# Altium schematic sheet sensor.SchDoc
size A4
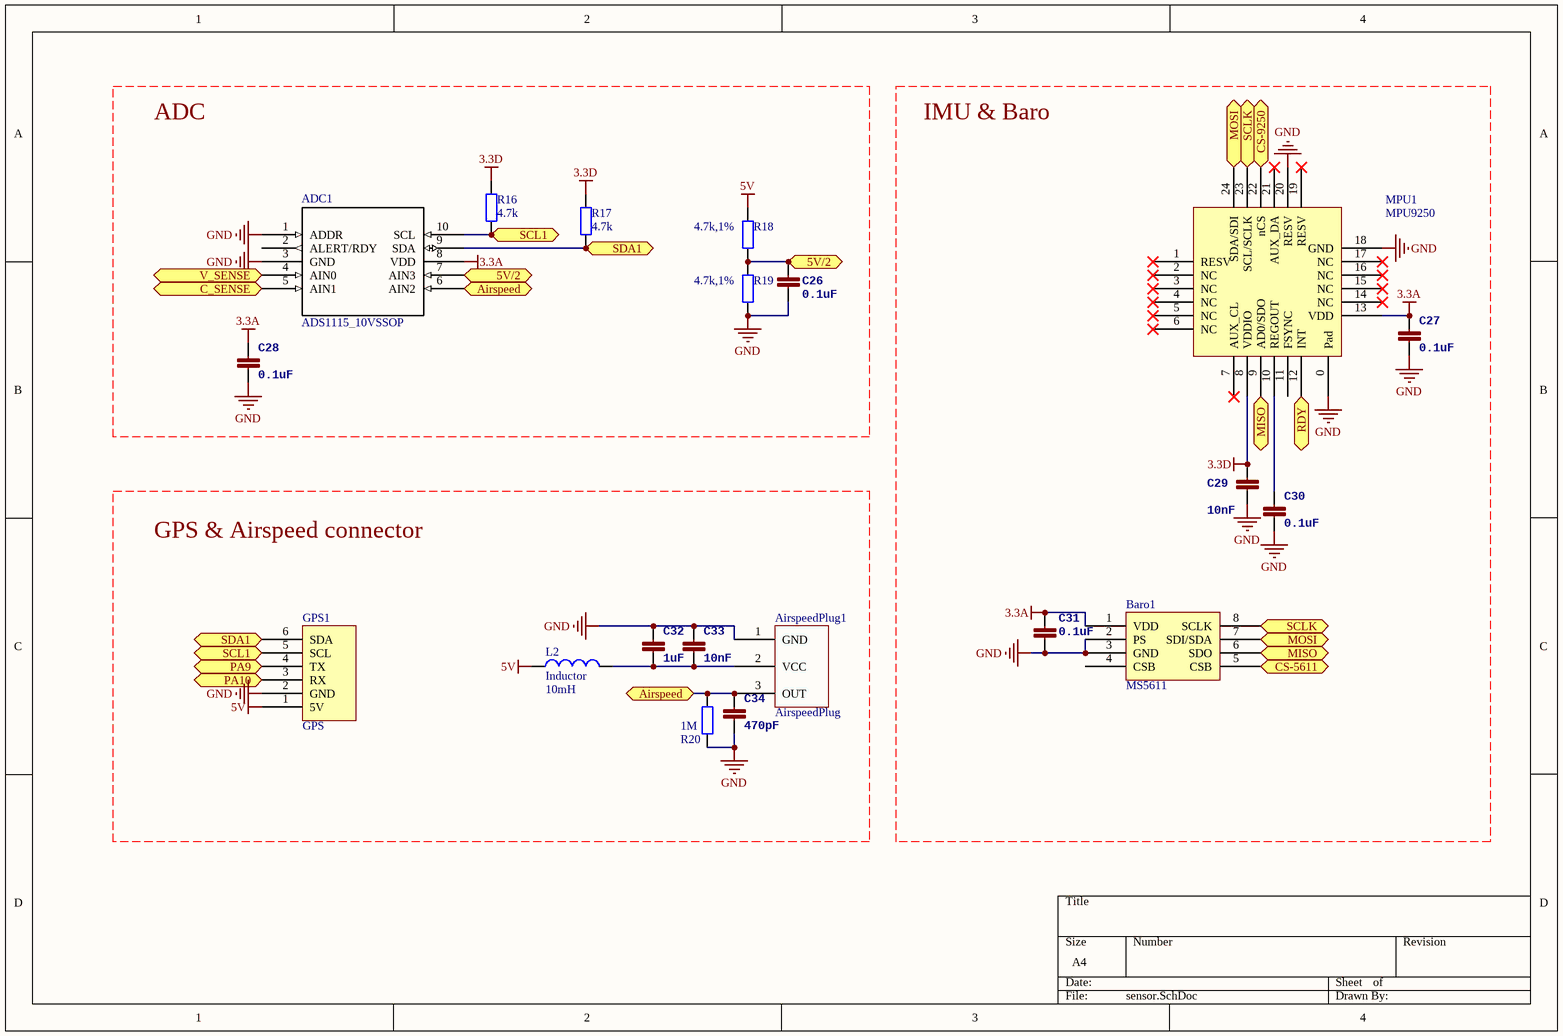
[diagram p0: sensor.SchDoc]

## Parts
ADC1  ADS1115_10VSSOP  [10VSSOP]
AirspeedPlug1  AirspeedPlug  [ServoConnector]
Baro1  MS5611  [MS5611]
C26  0.1uF  [0402]
C27  0.1uF  [0402]
C28  0.1uF  [0402]
C29  10nF  [0402]
C30  0.1uF  [0402]
C31  0.1uF  [0402]
C32  1uF  [0402]
C33  10nF  [0402]
C34  470pF  [0402]
GPS1  GPS  [WFRSM125]
L2  Inductor  value 10mH  [0603]
MPU1  MPU9250  [MPU9250]
R16  4.7k  [0402]
R17  4.7k  [0402]
R18  4.7k,1%  [0402]
R19  4.7k,1%  [0402]
R20  value 1M  [0402]

## Ports
5V/2, Airspeed, C_SENSE, CS-5611, CS-9250, MISO, MOSI, PA9, PA10, RDY, SCL1, SCLK, SDA1, V_SENSE

## Nets
3.3A: ADC1.8(VDD) Baro1.1(VDD) C27.1 C28.1 C31.1 MPU1.13(VDD)
3.3D: C29.1 MPU1.8(VDDIO) R16.1 R17.2
5V: GPS1.1(5V) L2.1 R18.1
GND: ADC1.1(ADDR) ADC1.3(GND) AirspeedPlug1.1(GND) Baro1.2(PS) Baro1.3(GND) C26.1 C27.2 C28.2 C29.2 C30.2 C31.2 C32.1 C33.1 C34.2 GPS1.2(GND) MPU1.0(Pad) MPU1.18(GND) MPU1.20(RESV) R19.2 R20.2
5V/2: ADC1.7(AIN3) C26.2 R18.2 R19.1 ; port 5V/2
Airspeed: ADC1.6(AIN2) AirspeedPlug1.3(OUT) C34.1 R20.1 ; port Airspeed
C_SENSE: ADC1.5(AIN1) ; port C_SENSE
CS-5611: Baro1.5(CSB) ; port CS-5611
CS-9250: MPU1.22(nCS) ; port CS-9250
MISO: Baro1.6(SDO) MPU1.9(AD0/SDO) ; port MISO
MOSI: Baro1.7(SDI/SDA) MPU1.24(SDA/SDI) ; port MOSI
PA9: GPS1.4(TX) ; port PA9
PA10: GPS1.3(RX) ; port PA10
RDY: MPU1.12(INT) ; port RDY
SCL1: ADC1.10(SCL) GPS1.5(SCL) R16.2 ; port SCL1
SCLK: Baro1.8(SCLK) MPU1.23(SCL/SCLK) ; port SCLK
SDA1: ADC1.9(SDA) GPS1.6(SDA) R17.1 ; port SDA1
V_SENSE: ADC1.4(AIN0) ; port V_SENSE
NetAirspeedPlug1_2: AirspeedPlug1.2(VCC) C32.2 C33.2 L2.2
NetC30_1: C30.1 MPU1.10(REGOUT)

Not connected (* = marked no-connect by the designer): ADC1 2(ALERT/RDY); Baro1 4(CSB); MPU1 1(RESV)* 2(NC)* 3(NC)* 4(NC)* 5(NC)* 6(NC)* 7(AUX_CL)* 11(FSYNC) 14(NC)* 15(NC)* 16(NC)* 17(NC)* 19(RESV)* 21(AUX_DA)*

## Notes on the sheet
- ADC
- IMU & Baro
- GPS & Airspeed connector

## Library data of the parts
ADC1 = ADS1115_10VSSOP: Manufacturer: Texas Instruments; INDUSTRY_STD_PKG_TYPE: MSOP; FAMILY_NAME: PRECISION ADC (<=10MSPS); PIN_COUNT: 10; PACKAGE_DESIGNATOR: DGS; Datasheet URL: http://www.ti.com/lit/gpn/ADS1115; GENERIC_PART_NUMBER: ADS1115; RefDes: RefDes; Type: DEV; Value: Value
C26-C34 = CAP0402-CAP: <b>Capacitor</b> / Standard 0603 ceramic capacitor, and 0.1" leaded capacitor.; PARTNO: CC0402ZRY5V7BB104
L2 = Inductor: Code_IEC: 1005; Published: 8-Jun-2000; LatestRevisionDate: 29-May-2009; LatestRevisionNote: IPC-7351 Footprint Added.; PackageReference: 0402-A; Publisher: Altium Limited; PackageDescription: Chip Inductor; Code_JEITA: 0402
R16-R19 = Res2: Resistor; Value: 0Ohm; Published: 8-Jun-2000; LatestRevisionDate: 17-Jul-2002; LatestRevisionNote: Re-released for DXP Platform.; PackageReference: AXIAL-0.4; Publisher: Altium Limited; PackageDescription: Axial Device, Thru-Hole; 2 Leads; 0.4 in Pin Spacing
R20 = Res2: Resistor; Published: 8-Jun-2000; LatestRevisionDate: 17-Jul-2002; LatestRevisionNote: Re-released for DXP Platform.; PackageReference: AXIAL-0.4; Publisher: Altium Limited; PackageDescription: Axial Device, Thru-Hole; 2 Leads; 0.4 in Pin Spacing